# EAGLE design ATtinyTrafficLight (EAGLE 7.5.0)
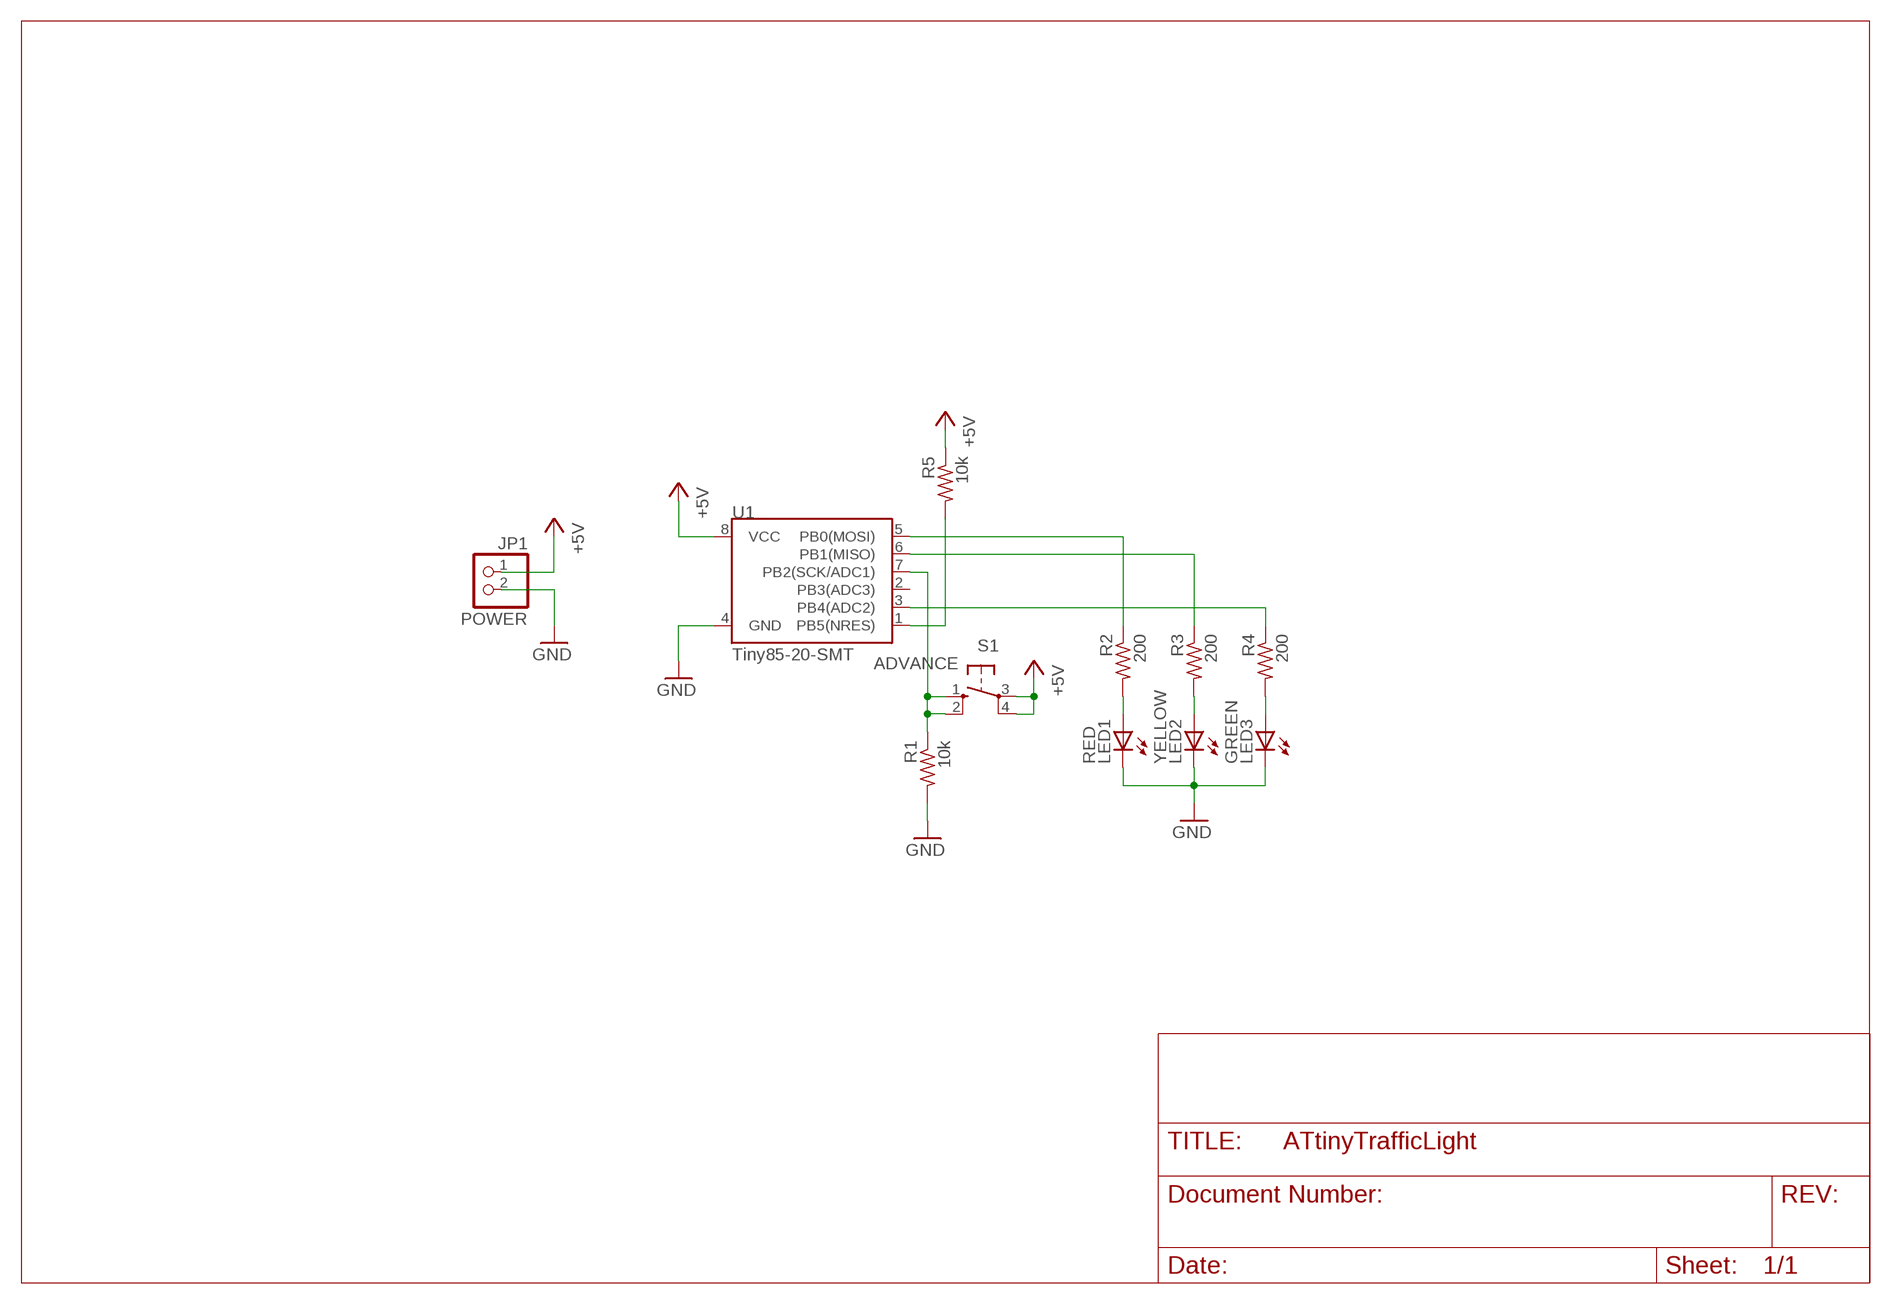
[diagram p0: schematic, sheet 1]

## Parts
JP1  POWER  PINHD-1X2  [1X02]
LED1  RED  LEDCHIPLED_0805  [CHIPLED_0805]
LED2  YELLOW  LEDCHIPLED_0805  [CHIPLED_0805]
LED3  GREEN  LEDCHIPLED_0805  [CHIPLED_0805]
R1  10k  R-US_R0805  [R0805]
R2  200  R-US_R0805  [R0805]
R3  200  R-US_R0805  [R0805]
R4  200  R-US_R0805  [R0805]
R5  10k  R-US_R0805  [R0805]
S1  ADVANCE  10-XX  [B3F-10XX]
U1  Tiny85-20-SMT  ATTINY45TINY85-20-SMT  [SO08-EIAJ]

## Nets
+5V: JP1.1 R5.1 S1.3(P) S1.4(P1) U1.8(VCC)
GND: JP1.2 LED1.C LED2.C LED3.C R1.2 U1.4(GND)
N$1: R5.2 U1.1(PB5(NRES))
N$2: R2.1 U1.5(PB0(MOSI))
N$3: R3.1 U1.6(PB1(MISO))
N$4: R1.1 S1.1(S) S1.2(S1) U1.7(PB2(SCK/ADC1))
N$5: R4.1 U1.3(PB4(ADC2))
N$6: LED1.A R2.2
N$7: LED2.A R3.2
N$8: LED3.A R4.2
Unconnected: U1.2(PB3(ADC3))

## Library data of the parts
JP1 = pinhead:PINHD-1X2: PIN HEADER
LED1-LED3 = led:LED: LED OSRAM: - CHIPLED LG R971, LG N971, LY N971, LG Q971, LY Q971, LO R971, LY R971 LH N974, LH R974 LS Q976, LO Q976, LY Q976 LO Q996 - Hyper CHIPLED LW Q18S LB Q993, LB Q99A, LB R99A - SideLED LS A670, LO A670, LY A670, LG A670, LP A670 LB A673, LV A673, LT A673, LW A673 LH A674 LY A675 LS A676, LA A676, LO A676, LY A676, LW A676 LS A679, LY A679, LG A679 - Hyper Micro SIDELED® LS Y876, LA Y876, LO Y876, LY Y876 LT Y87S - SmartLED LW L88C, LW L88S LB L89C, LB L89S, LG L890 LS L89K, LO L89K, LY L89K LS L896, LA L896, LO L896, LY L896 - TOPLED LS T670, LO T670, LY T670, LG T670, LP T670 LSG T670, LSP T670, LSY T670, LOP T670, LYG T670 LG T671, LOG T671, LSG T671 LB T673, LV T673, LT T673, LW T673 LH T674 LS T676, LA T676, LO T676, LY T676, LB T676, LH T676, LSB T676, LW T676 LB T67C, LV T67C, LT T67C, LS T67K, LO T67K, LY T67K, LW E67C LS E67B, LA E67B, LO E67B, LY E67B, LB E67C, LV E67C, LT E67C LW T67C LS T679, LY T679, LG T679 LS T770, LO T770, LY T770, LG T770, LP T770 LB T773, LV T773, LT T773, LW T773 LH T774 LS E675, LA E675, LY E675, LS T675 LS T776, LA T776, LO T776, LY T776, LB T776 LHGB T686 LT T68C, LB T68C - Hyper Mini TOPLED® LB M676 - Mini TOPLED Santana® LG M470 LS M47K, LO M47K, LY M47K Source: http://www.osram.convergy.de LUXEON: - LUMILED® LXK2-PW12-R00, LXK2-PW12-S00, LXK2-PW14-U00, LXK2-PW14-V00 LXK2-PM12-R00, LXK2-PM12-S00, LXK2-PM14-U00 LXK2-PE12-Q00, LXK2-PE12-R00, LXK2-PE12-S00, LXK2-PE14-T00, LXK2-PE14-U00 LXK2-PB12-K00, LXK2-PB12-L00, LXK2-PB12-M00, LXK2-PB14-N00, LXK2-PB14-P00, LXK2-PB14-Q00 LXK2-PR12-L00, LXK2-PR12-M00, LXK2-PR14-Q00, LXK2-PR14-R00 LXK2-PD12-Q00, LXK2-PD12-R00, LXK2-PD12-S00 LXK2-PH12-R00, LXK2-PH12-S00 LXK2-PL12-P00, LXK2-PL12-Q00, LXK2-PL12-R00 Source: www.luxeon.com KINGBRIGHT: KA-3528ASYC Source: www.kingbright.com
R1-R5 = resistor:R-US_: RESISTOR, American symbol
S1 = switch-omron:10-XX: OMRON SWITCH; MPN: B3F-1000; OC_FARNELL: 176432; OC_NEWARK: 36M3542
U1 = SparkFun-DigitalIC:ATTINY45: Atmel 8-pin 2/4/8kB flash uC; PROD_ID: IC-09092

## Board
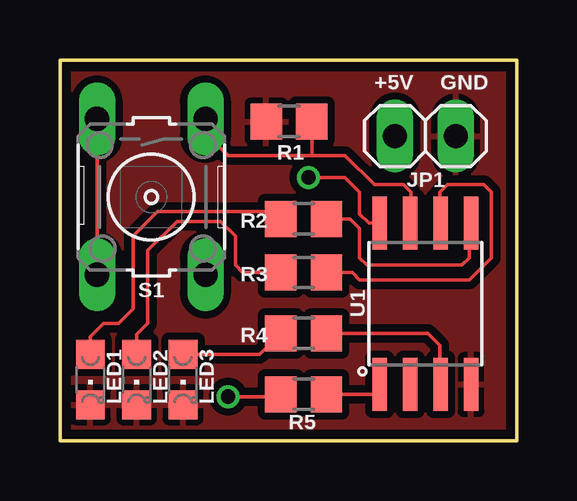
[diagram p1: board, top side]
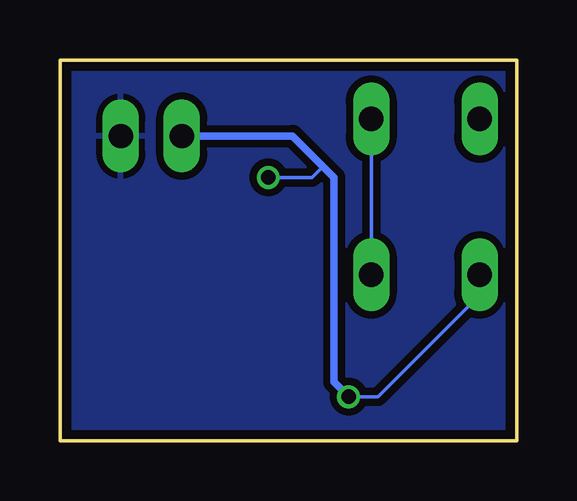
[diagram p2: board, bottom side, seen from below]

Size 19.05 x 15.88 mm. Coordinates in mm from the lower left corner, seen from the top.
Outline: 0,0 0,15.88 19.05,15.88 19.05,0 0,0
Copper layers (1*16): Top 0.0356mm / dielectric 1.5011mm / Bottom 0.0356mm
Design rules "LaenPCBOrder": minimum track width 6mil, minimum drill 13mil, track to track 6mil, track to pad 6mil, pad to pad 6mil, via to via 6mil, smd to smd 6mil, copper to edge 15mil, drill to drill 6mil, minimum pad ring 7mil, minimum via ring 7mil, stop-mask expansion 3mil, vias tented up to drill 0mil, thermal gap 10mil

### Footprints (pad centres in the part's own frame; a part is rotated, then mirrored left to right if it is on the bottom)
1X02 = drill 1.016 long: 1 -1.27,0; 2 1.27,0
CHIPLED_0805 = smd 1.2 x 1.2: A 0,-1.05; C 0,1.05
R0805 = smd 1.3 x 1.5: 1 -0.95,0; 2 0.95,0
B3F-10XX = drill 1.016 long: 1 -3.251,2.261; 2 3.251,2.261; 3 -3.251,-2.261; 4 3.251,-2.261
SO08-EIAJ = smd 0.61 x 2.21: 1 -1.905,-3.378; 2 -0.635,-3.378; 3 0.635,-3.378; 4 1.905,-3.378; 5 1.905,3.353; 6 0.635,3.353; 7 -0.635,3.353; 8 -1.905,3.353

### Placement (x,y rotation side)
JP1  15.24,12.7 0 top
LED1  1.27,2.54 180 top
LED2  3.2,2.54 180 top
LED3  5.13,2.54 180 top
R1  9.55,13.31 180 top
R2  10.16,9.25 180 top
R3  10.16,7.01 180 top
R4  10.16,4.47 180 top
R5  10.16,1.93 0 top
S1  3.81,10.16 270 top
U1  15.24,5.71 0 top

### Tracks (layer width: path | path; a pad name or v marks a point on that pad's centre or on a via)
+5V  (via drill 0.6)
  Top 0.152: S1.4 S1.3 | v7.01,1.83 9.11,1.83 R5.1 | U1.8 12.88,9.07 12.5,9.45 12.5,10.36 11.89,10.97 v10.36,10.97
  Bottom 0.152: S1.4 1.55,6.07 5.79,1.83 v7.01,1.83 | v10.36,10.97 8.53,10.97 8.08,11.43
  Bottom 0.305: JP1.1 9.35,12.7 8.08,11.43 7.62,10.97 7.62,2.44 v7.01,1.83
GND
  pour Top (isolate 0.305): 0,0 0,15.88 19.05,15.88 19.05,0
  pour Bottom (isolate 0.305): 0,0 0,15.88 19.05,15.88 19.05,0
N$1
  Top 0.152: R5.2 13.34,1.93 U1.1
N$2
  Top 0.152: U1.5 17.07,8.99 17.07,7.62 16.76,7.32 12.8,7.32 12.5,7.62 12.5,8.84 12.09,9.25 R2.1
N$3
  Top 0.152: R3.1 12.19,7.01 12.5,6.71 17.07,6.71 17.98,7.62 17.98,10.36 17.68,10.67 16.15,10.67 15.85,10.36 15.85,9.09 U1.6
N$4
  Top 0.152: S1.1 6.07,12.83 7.01,11.89 10.5,11.89 | 10.5,11.89 R1.1 | 10.5,11.89 11.89,11.89 13.11,10.67 14.33,10.67 14.63,10.36 14.63,9.09 U1.7
  Bottom 0.152: S1.2 S1.1
N$5
  Top 0.152: R4.1 15.34,4.47 15.85,3.96 15.85,2.36 U1.3
N$6
  Top 0.152: LED1.A 1.27,4.32 1.83,4.88 2.44,4.88 3.05,5.49 3.05,8.53 4.06,9.55 8.9,9.55 R2.2
N$7
  Top 0.152: LED2.A 3.2,4.42 3.66,4.88 3.66,7.92 4.88,9.14 6.71,9.14 7.32,8.53 7.32,7.32 7.62,7.01 R3.2
N$8
  Top 0.152: LED3.A 8.33,3.59 R4.2

### Text on the board
tPlace: +5V | GND